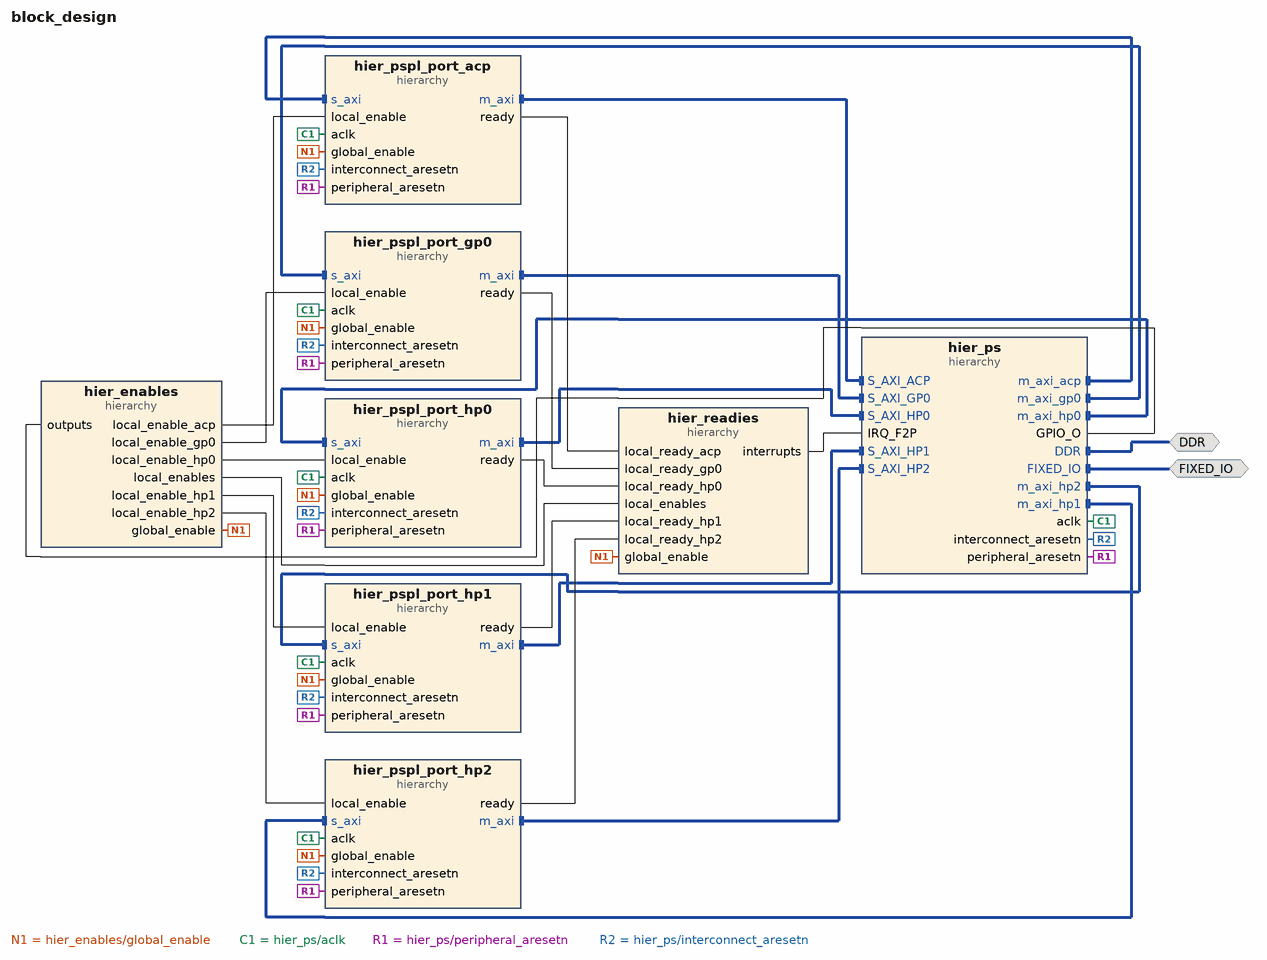
[diagram p0: block diagram of the top level]
# Vivado block design block_design, Vivado 2015.3
create_bd_design block_design

create_bd_intf_port -mode Master -vlnv xilinx.com:interface:ddrx_rtl:1.0 DDR
create_bd_intf_port -mode Master -vlnv xilinx.com:display_processing_system7:fixedio_rtl:1.0 FIXED_IO

create_bd_cell -type hier hier_pspl_port_acp
create_bd_cell -type hier hier_pspl_port_hp0
create_bd_cell -type hier hier_pspl_port_gp0
create_bd_cell -type hier hier_pspl_port_hp1
create_bd_cell -type hier hier_pspl_port_hp2
create_bd_cell -type hier hier_enables
create_bd_cell -type hier hier_readies
create_bd_cell -type hier hier_ps

# ---- hierarchy /hier_pspl_port_acp ----
current_bd_instance /hier_pspl_port_acp
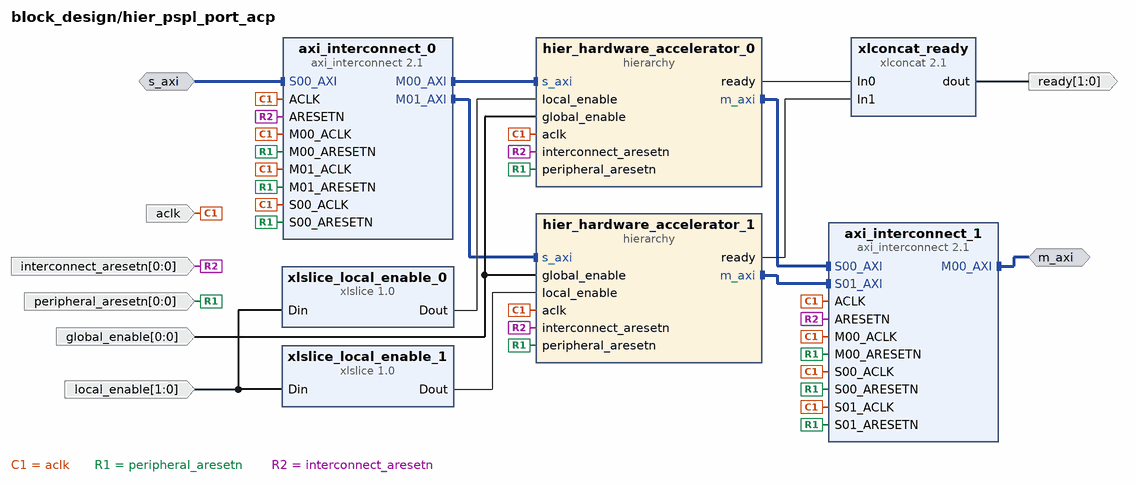
[diagram p1: block diagram inside /hier_pspl_port_acp]
create_bd_intf_pin -mode Master -vlnv xilinx.com:interface:aximm_rtl:1.0 m_axi
create_bd_intf_pin -mode Slave -vlnv xilinx.com:interface:aximm_rtl:1.0 s_axi
create_bd_pin -dir O -from 1 -to 0 ready
create_bd_pin -dir I -from 1 -to 0 local_enable
create_bd_pin -dir I -from 0 -to 0 global_enable
create_bd_pin -dir I aclk
create_bd_pin -dir I -from 0 -to 0 peripheral_aresetn
create_bd_pin -dir I -from 0 -to 0 interconnect_aresetn

create_bd_cell -type hier hier_hardware_accelerator_0
create_bd_cell -type hier hier_hardware_accelerator_1
create_bd_cell -type ip -vlnv xilinx.com:ip:axi_interconnect:2.1 axi_interconnect_0
set_property -dict {CONFIG.NUM_MI 2 CONFIG.STRATEGY 2} [get_bd_cells axi_interconnect_0]
create_bd_cell -type ip -vlnv xilinx.com:ip:axi_interconnect:2.1 axi_interconnect_1
set_property -dict {CONFIG.NUM_SI 2 CONFIG.NUM_MI 1 CONFIG.STRATEGY 2} [get_bd_cells axi_interconnect_1]
create_bd_cell -type ip -vlnv xilinx.com:ip:xlconcat:2.1 xlconcat_ready
create_bd_cell -type ip -vlnv xilinx.com:ip:xlslice:1.0 xlslice_local_enable_0
set_property -dict {CONFIG.DIN_WIDTH 2} [get_bd_cells xlslice_local_enable_0]
create_bd_cell -type ip -vlnv xilinx.com:ip:xlslice:1.0 xlslice_local_enable_1
set_property -dict {CONFIG.DIN_TO 1 CONFIG.DIN_FROM 1 CONFIG.DIN_WIDTH 2} [get_bd_cells xlslice_local_enable_1]

# ---- hierarchy /hier_pspl_port_acp/hier_hardware_accelerator_0 ----
current_bd_instance /hier_pspl_port_acp/hier_hardware_accelerator_0
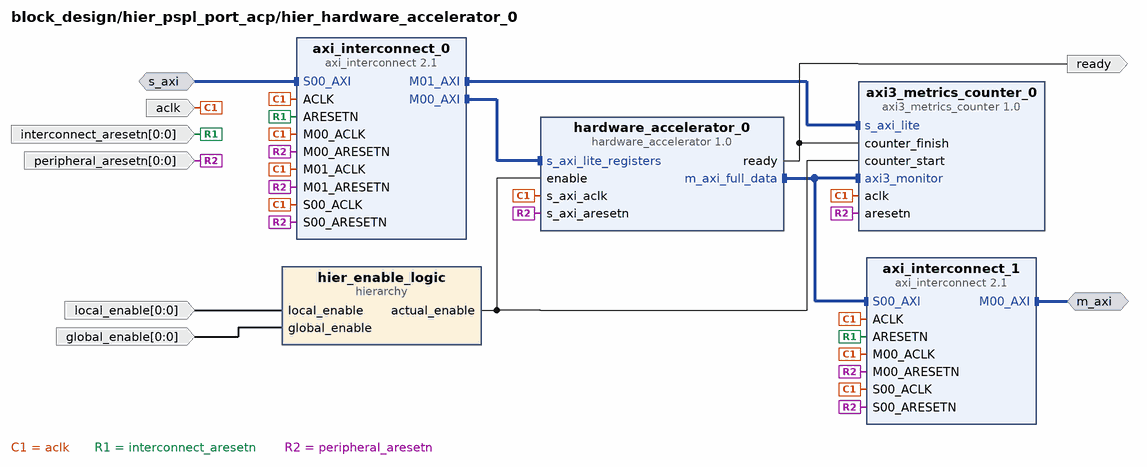
[diagram p2: block diagram inside /hier_pspl_port_acp/hier_hardware_accelerator_0]
create_bd_intf_pin -mode Slave -vlnv xilinx.com:interface:aximm_rtl:1.0 s_axi
create_bd_intf_pin -mode Master -vlnv xilinx.com:interface:aximm_rtl:1.0 m_axi
create_bd_pin -dir I -from 0 -to 0 local_enable
create_bd_pin -dir I -from 0 -to 0 global_enable
create_bd_pin -dir I aclk
create_bd_pin -dir I -from 0 -to 0 peripheral_aresetn
create_bd_pin -dir I -from 0 -to 0 interconnect_aresetn
create_bd_pin -dir O ready

create_bd_cell -type ip -vlnv xilinx.com:user:axi3_metrics_counter:1.0 axi3_metrics_counter_0
set_property -dict {CONFIG.C_axi3_monitor_ID_WIDTH 2 CONFIG.C_axi3_monitor_DATA_WIDTH 64} [get_bd_cells axi3_metrics_counter_0]
create_bd_cell -type hier hier_enable_logic
create_bd_cell -type ip -vlnv xilinx.com:ip:axi_interconnect:2.1 axi_interconnect_0
set_property -dict {CONFIG.STRATEGY 2} [get_bd_cells axi_interconnect_0]
create_bd_cell -type ip -vlnv xilinx.com:ip:axi_interconnect:2.1 axi_interconnect_1
set_property -dict {CONFIG.NUM_MI 1} [get_bd_cells axi_interconnect_1]
create_bd_cell -type ip -vlnv xilinx.com:user:hardware_accelerator:1.0 hardware_accelerator_0
set_property -dict [list \
  CONFIG.C_m_axi_full_data_DATA_WIDTH 64 \
  CONFIG.C_buffer_size 4 \
  CONFIG.C_m_axi_full_data_ID_WIDTH 2 \
] [get_bd_cells hardware_accelerator_0]

# ---- hierarchy /hier_pspl_port_acp/hier_hardware_accelerator_0/hier_enable_logic ----
current_bd_instance /hier_pspl_port_acp/hier_hardware_accelerator_0/hier_enable_logic
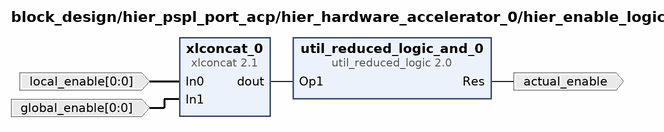
[diagram p3: block diagram inside /hier_pspl_port_acp/hier_hardware_accelerator_0/hier_enable_logic]
create_bd_pin -dir I -from 0 -to 0 local_enable
create_bd_pin -dir I -from 0 -to 0 global_enable
create_bd_pin -dir O actual_enable

create_bd_cell -type ip -vlnv xilinx.com:ip:util_reduced_logic:2.0 util_reduced_logic_and_0
set_property -dict {CONFIG.C_SIZE 2} [get_bd_cells util_reduced_logic_and_0]
create_bd_cell -type ip -vlnv xilinx.com:ip:xlconcat:2.1 xlconcat_0

# ---- hierarchy /hier_pspl_port_acp/hier_hardware_accelerator_1 ----
current_bd_instance /hier_pspl_port_acp/hier_hardware_accelerator_1
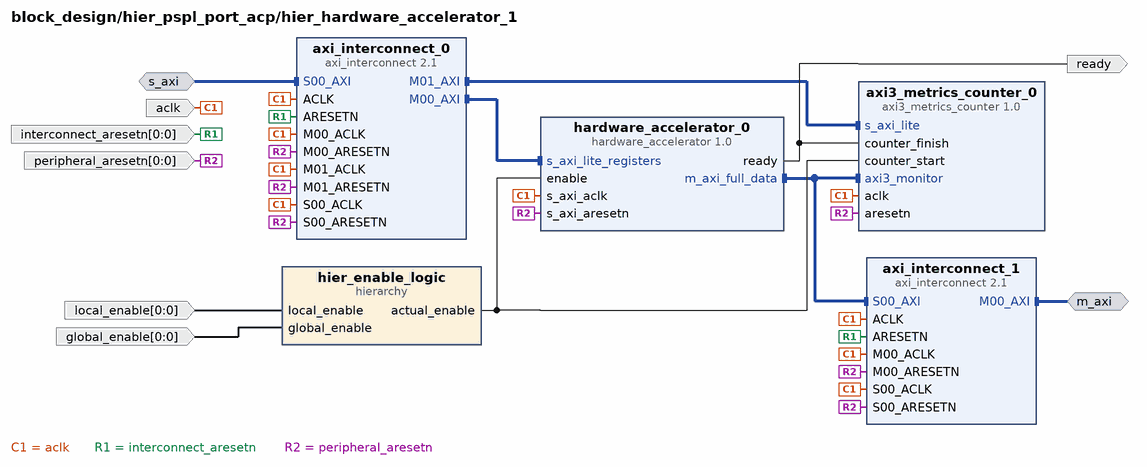
[diagram p4: block diagram inside /hier_pspl_port_acp/hier_hardware_accelerator_1]
create_bd_intf_pin -mode Slave -vlnv xilinx.com:interface:aximm_rtl:1.0 s_axi
create_bd_intf_pin -mode Master -vlnv xilinx.com:interface:aximm_rtl:1.0 m_axi
create_bd_pin -dir I -from 0 -to 0 local_enable
create_bd_pin -dir I -from 0 -to 0 global_enable
create_bd_pin -dir I aclk
create_bd_pin -dir I -from 0 -to 0 peripheral_aresetn
create_bd_pin -dir I -from 0 -to 0 interconnect_aresetn
create_bd_pin -dir O ready

create_bd_cell -type ip -vlnv xilinx.com:user:axi3_metrics_counter:1.0 axi3_metrics_counter_0
set_property -dict {CONFIG.C_axi3_monitor_ID_WIDTH 2 CONFIG.C_axi3_monitor_DATA_WIDTH 64} [get_bd_cells axi3_metrics_counter_0]
create_bd_cell -type hier hier_enable_logic
create_bd_cell -type ip -vlnv xilinx.com:ip:axi_interconnect:2.1 axi_interconnect_0
set_property -dict {CONFIG.STRATEGY 2} [get_bd_cells axi_interconnect_0]
create_bd_cell -type ip -vlnv xilinx.com:ip:axi_interconnect:2.1 axi_interconnect_1
set_property -dict {CONFIG.NUM_MI 1} [get_bd_cells axi_interconnect_1]
create_bd_cell -type ip -vlnv xilinx.com:user:hardware_accelerator:1.0 hardware_accelerator_0
set_property -dict [list \
  CONFIG.C_m_axi_full_data_DATA_WIDTH 64 \
  CONFIG.C_buffer_size 4 \
  CONFIG.C_m_axi_full_data_ID_WIDTH 2 \
  CONFIG.C_m_axi_full_data_ID 2 \
] [get_bd_cells hardware_accelerator_0]

# ---- hierarchy /hier_pspl_port_acp/hier_hardware_accelerator_1/hier_enable_logic ----
current_bd_instance /hier_pspl_port_acp/hier_hardware_accelerator_1/hier_enable_logic
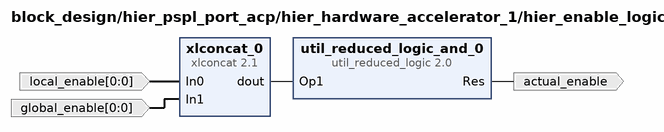
[diagram p5: block diagram inside /hier_pspl_port_acp/hier_hardware_accelerator_1/hier_enable_logic]
create_bd_pin -dir I -from 0 -to 0 local_enable
create_bd_pin -dir I -from 0 -to 0 global_enable
create_bd_pin -dir O actual_enable

create_bd_cell -type ip -vlnv xilinx.com:ip:util_reduced_logic:2.0 util_reduced_logic_and_0
set_property -dict {CONFIG.C_SIZE 2} [get_bd_cells util_reduced_logic_and_0]
create_bd_cell -type ip -vlnv xilinx.com:ip:xlconcat:2.1 xlconcat_0

# ---- hierarchy /hier_pspl_port_hp0 ----
current_bd_instance /hier_pspl_port_hp0
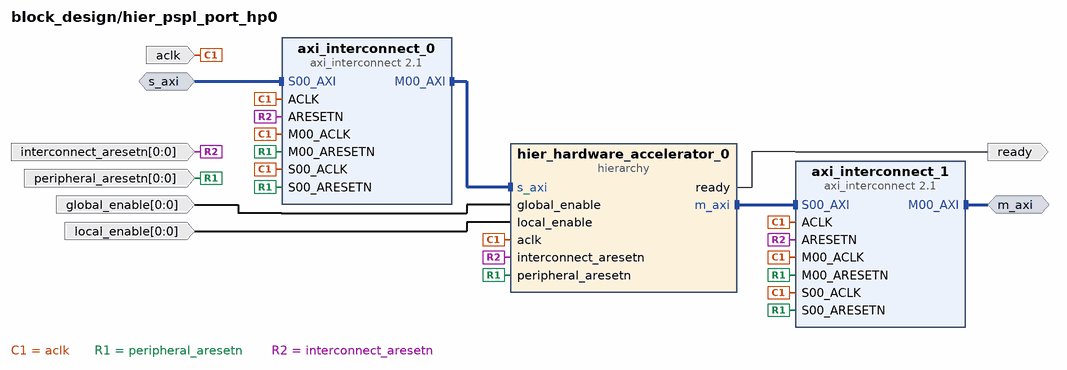
[diagram p6: block diagram inside /hier_pspl_port_hp0]
create_bd_intf_pin -mode Master -vlnv xilinx.com:interface:aximm_rtl:1.0 m_axi
create_bd_intf_pin -mode Slave -vlnv xilinx.com:interface:aximm_rtl:1.0 s_axi
create_bd_pin -dir O ready
create_bd_pin -dir I -from 0 -to 0 local_enable
create_bd_pin -dir I -from 0 -to 0 global_enable
create_bd_pin -dir I aclk
create_bd_pin -dir I -from 0 -to 0 peripheral_aresetn
create_bd_pin -dir I -from 0 -to 0 interconnect_aresetn

create_bd_cell -type hier hier_hardware_accelerator_0
create_bd_cell -type ip -vlnv xilinx.com:ip:axi_interconnect:2.1 axi_interconnect_0
set_property -dict {CONFIG.NUM_MI 1} [get_bd_cells axi_interconnect_0]
create_bd_cell -type ip -vlnv xilinx.com:ip:axi_interconnect:2.1 axi_interconnect_1
set_property -dict {CONFIG.NUM_MI 1} [get_bd_cells axi_interconnect_1]

# ---- hierarchy /hier_pspl_port_hp0/hier_hardware_accelerator_0 ----
current_bd_instance /hier_pspl_port_hp0/hier_hardware_accelerator_0
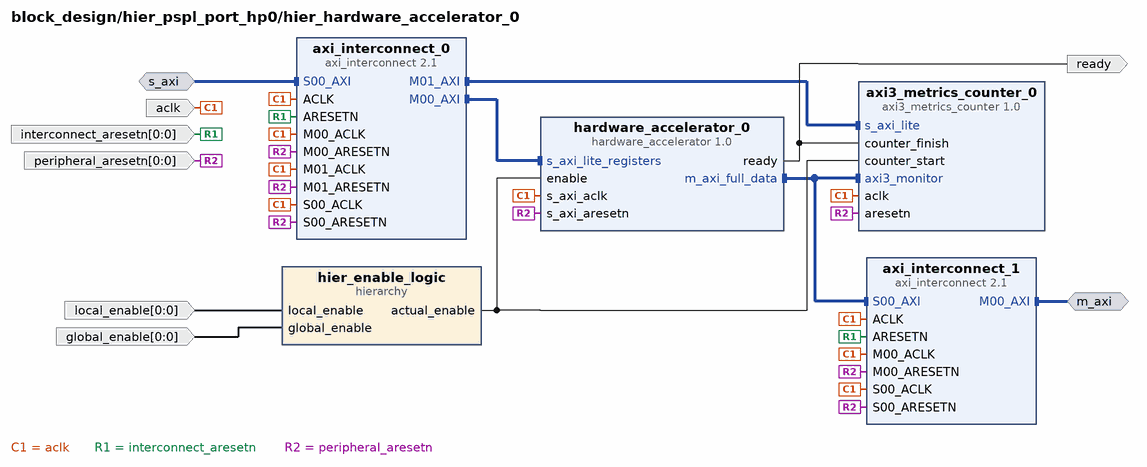
[diagram p7: block diagram inside /hier_pspl_port_hp0/hier_hardware_accelerator_0]
create_bd_intf_pin -mode Slave -vlnv xilinx.com:interface:aximm_rtl:1.0 s_axi
create_bd_intf_pin -mode Master -vlnv xilinx.com:interface:aximm_rtl:1.0 m_axi
create_bd_pin -dir I -from 0 -to 0 local_enable
create_bd_pin -dir I -from 0 -to 0 global_enable
create_bd_pin -dir I aclk
create_bd_pin -dir I -from 0 -to 0 peripheral_aresetn
create_bd_pin -dir I -from 0 -to 0 interconnect_aresetn
create_bd_pin -dir O ready

create_bd_cell -type ip -vlnv xilinx.com:user:axi3_metrics_counter:1.0 axi3_metrics_counter_0
set_property -dict {CONFIG.C_axi3_monitor_ID_WIDTH 6} [get_bd_cells axi3_metrics_counter_0]
create_bd_cell -type hier hier_enable_logic
create_bd_cell -type ip -vlnv xilinx.com:ip:axi_interconnect:2.1 axi_interconnect_0
create_bd_cell -type ip -vlnv xilinx.com:ip:axi_interconnect:2.1 axi_interconnect_1
set_property -dict {CONFIG.NUM_MI 1} [get_bd_cells axi_interconnect_1]
create_bd_cell -type ip -vlnv xilinx.com:user:hardware_accelerator:1.0 hardware_accelerator_0
set_property -dict {CONFIG.C_buffer_size 4 CONFIG.C_m_axi_full_data_ID_WIDTH 6} [get_bd_cells hardware_accelerator_0]

# ---- hierarchy /hier_pspl_port_hp0/hier_hardware_accelerator_0/hier_enable_logic ----
current_bd_instance /hier_pspl_port_hp0/hier_hardware_accelerator_0/hier_enable_logic
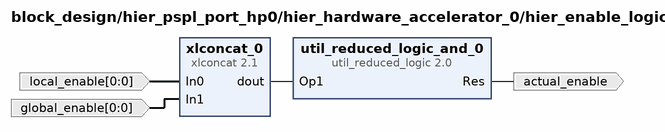
[diagram p8: block diagram inside /hier_pspl_port_hp0/hier_hardware_accelerator_0/hier_enable_logic]
create_bd_pin -dir I -from 0 -to 0 local_enable
create_bd_pin -dir I -from 0 -to 0 global_enable
create_bd_pin -dir O actual_enable

create_bd_cell -type ip -vlnv xilinx.com:ip:util_reduced_logic:2.0 util_reduced_logic_and_0
set_property -dict {CONFIG.C_SIZE 2} [get_bd_cells util_reduced_logic_and_0]
create_bd_cell -type ip -vlnv xilinx.com:ip:xlconcat:2.1 xlconcat_0

# ---- hierarchy /hier_pspl_port_gp0 ----
current_bd_instance /hier_pspl_port_gp0
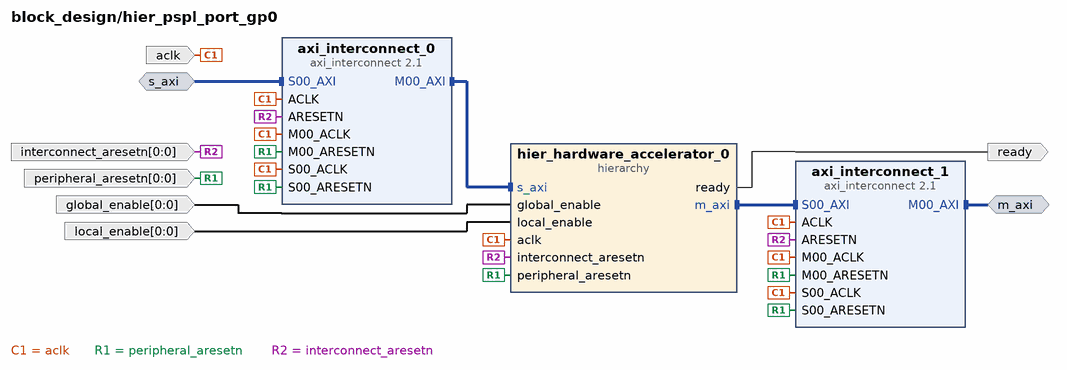
[diagram p9: block diagram inside /hier_pspl_port_gp0]
create_bd_intf_pin -mode Master -vlnv xilinx.com:interface:aximm_rtl:1.0 m_axi
create_bd_intf_pin -mode Slave -vlnv xilinx.com:interface:aximm_rtl:1.0 s_axi
create_bd_pin -dir O ready
create_bd_pin -dir I -from 0 -to 0 local_enable
create_bd_pin -dir I -from 0 -to 0 global_enable
create_bd_pin -dir I aclk
create_bd_pin -dir I -from 0 -to 0 peripheral_aresetn
create_bd_pin -dir I -from 0 -to 0 interconnect_aresetn

create_bd_cell -type hier hier_hardware_accelerator_0
create_bd_cell -type ip -vlnv xilinx.com:ip:axi_interconnect:2.1 axi_interconnect_0
set_property -dict {CONFIG.NUM_MI 1} [get_bd_cells axi_interconnect_0]
create_bd_cell -type ip -vlnv xilinx.com:ip:axi_interconnect:2.1 axi_interconnect_1
set_property -dict {CONFIG.NUM_MI 1} [get_bd_cells axi_interconnect_1]

# ---- hierarchy /hier_pspl_port_gp0/hier_hardware_accelerator_0 ----
current_bd_instance /hier_pspl_port_gp0/hier_hardware_accelerator_0
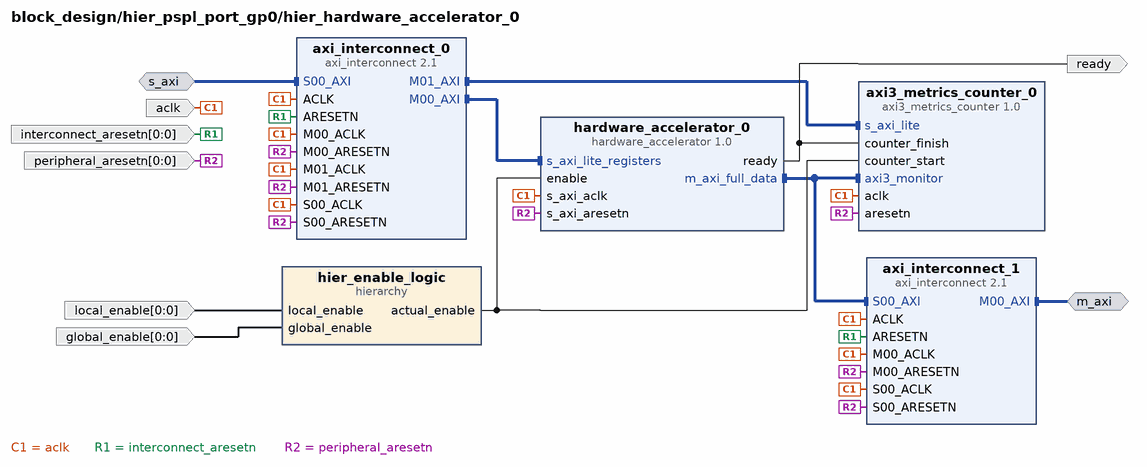
[diagram p10: block diagram inside /hier_pspl_port_gp0/hier_hardware_accelerator_0]
create_bd_intf_pin -mode Slave -vlnv xilinx.com:interface:aximm_rtl:1.0 s_axi
create_bd_intf_pin -mode Master -vlnv xilinx.com:interface:aximm_rtl:1.0 m_axi
create_bd_pin -dir I -from 0 -to 0 local_enable
create_bd_pin -dir I -from 0 -to 0 global_enable
create_bd_pin -dir I aclk
create_bd_pin -dir I -from 0 -to 0 peripheral_aresetn
create_bd_pin -dir I -from 0 -to 0 interconnect_aresetn
create_bd_pin -dir O ready

create_bd_cell -type ip -vlnv xilinx.com:user:axi3_metrics_counter:1.0 axi3_metrics_counter_0
set_property -dict {CONFIG.C_axi3_monitor_ID_WIDTH 6} [get_bd_cells axi3_metrics_counter_0]
create_bd_cell -type hier hier_enable_logic
create_bd_cell -type ip -vlnv xilinx.com:ip:axi_interconnect:2.1 axi_interconnect_0
create_bd_cell -type ip -vlnv xilinx.com:ip:axi_interconnect:2.1 axi_interconnect_1
set_property -dict {CONFIG.NUM_MI 1} [get_bd_cells axi_interconnect_1]
create_bd_cell -type ip -vlnv xilinx.com:user:hardware_accelerator:1.0 hardware_accelerator_0
set_property -dict {CONFIG.C_buffer_size 4 CONFIG.C_m_axi_full_data_ID_WIDTH 6} [get_bd_cells hardware_accelerator_0]

# ---- hierarchy /hier_pspl_port_gp0/hier_hardware_accelerator_0/hier_enable_logic ----
current_bd_instance /hier_pspl_port_gp0/hier_hardware_accelerator_0/hier_enable_logic
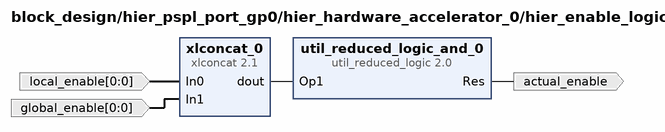
[diagram p11: block diagram inside /hier_pspl_port_gp0/hier_hardware_accelerator_0/hier_enable_logic]
create_bd_pin -dir I -from 0 -to 0 local_enable
create_bd_pin -dir I -from 0 -to 0 global_enable
create_bd_pin -dir O actual_enable

create_bd_cell -type ip -vlnv xilinx.com:ip:util_reduced_logic:2.0 util_reduced_logic_and_0
set_property -dict {CONFIG.C_SIZE 2} [get_bd_cells util_reduced_logic_and_0]
create_bd_cell -type ip -vlnv xilinx.com:ip:xlconcat:2.1 xlconcat_0

# ---- hierarchy /hier_pspl_port_hp1 ----
current_bd_instance /hier_pspl_port_hp1
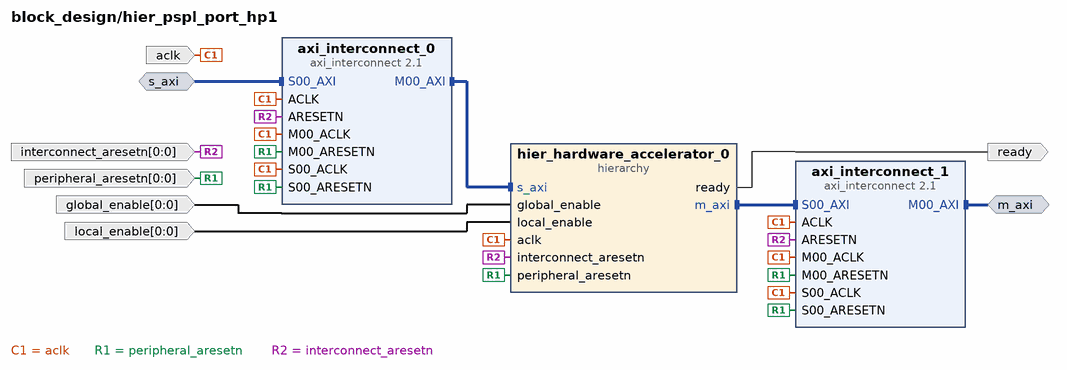
[diagram p12: block diagram inside /hier_pspl_port_hp1]
create_bd_intf_pin -mode Master -vlnv xilinx.com:interface:aximm_rtl:1.0 m_axi
create_bd_intf_pin -mode Slave -vlnv xilinx.com:interface:aximm_rtl:1.0 s_axi
create_bd_pin -dir O ready
create_bd_pin -dir I -from 0 -to 0 local_enable
create_bd_pin -dir I -from 0 -to 0 global_enable
create_bd_pin -dir I aclk
create_bd_pin -dir I -from 0 -to 0 peripheral_aresetn
create_bd_pin -dir I -from 0 -to 0 interconnect_aresetn

create_bd_cell -type hier hier_hardware_accelerator_0
create_bd_cell -type ip -vlnv xilinx.com:ip:axi_interconnect:2.1 axi_interconnect_0
set_property -dict {CONFIG.NUM_MI 1} [get_bd_cells axi_interconnect_0]
create_bd_cell -type ip -vlnv xilinx.com:ip:axi_interconnect:2.1 axi_interconnect_1
set_property -dict {CONFIG.NUM_MI 1} [get_bd_cells axi_interconnect_1]

# ---- hierarchy /hier_pspl_port_hp1/hier_hardware_accelerator_0 ----
current_bd_instance /hier_pspl_port_hp1/hier_hardware_accelerator_0
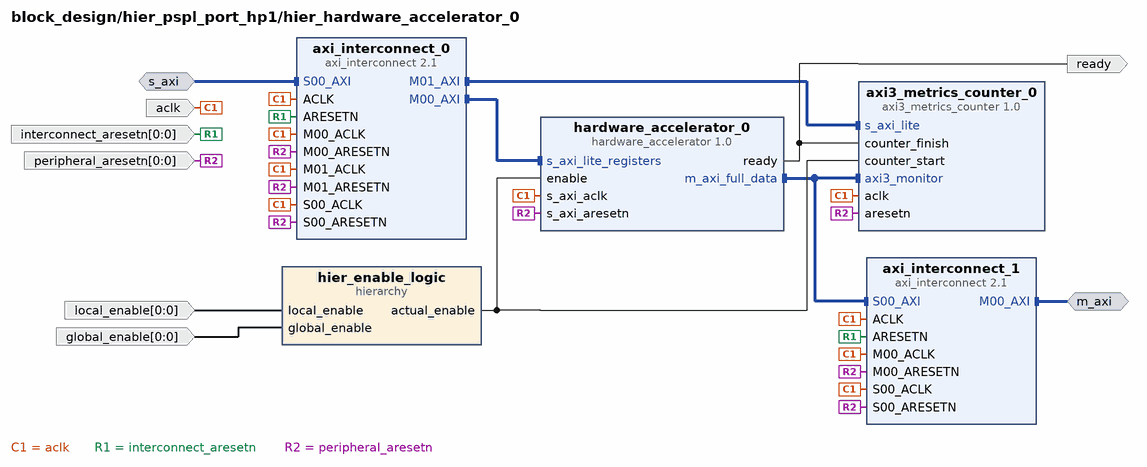
[diagram p13: block diagram inside /hier_pspl_port_hp1/hier_hardware_accelerator_0]
create_bd_intf_pin -mode Slave -vlnv xilinx.com:interface:aximm_rtl:1.0 s_axi
create_bd_intf_pin -mode Master -vlnv xilinx.com:interface:aximm_rtl:1.0 m_axi
create_bd_pin -dir I -from 0 -to 0 local_enable
create_bd_pin -dir I -from 0 -to 0 global_enable
create_bd_pin -dir I aclk
create_bd_pin -dir I -from 0 -to 0 peripheral_aresetn
create_bd_pin -dir I -from 0 -to 0 interconnect_aresetn
create_bd_pin -dir O ready

create_bd_cell -type ip -vlnv xilinx.com:user:axi3_metrics_counter:1.0 axi3_metrics_counter_0
set_property -dict {CONFIG.C_axi3_monitor_ID_WIDTH 6 CONFIG.C_axi3_monitor_DATA_WIDTH 64} [get_bd_cells axi3_metrics_counter_0]
create_bd_cell -type hier hier_enable_logic
create_bd_cell -type ip -vlnv xilinx.com:ip:axi_interconnect:2.1 axi_interconnect_0
create_bd_cell -type ip -vlnv xilinx.com:ip:axi_interconnect:2.1 axi_interconnect_1
set_property -dict {CONFIG.NUM_MI 1} [get_bd_cells axi_interconnect_1]
create_bd_cell -type ip -vlnv xilinx.com:user:hardware_accelerator:1.0 hardware_accelerator_0
set_property -dict [list \
  CONFIG.C_m_axi_full_data_DATA_WIDTH 64 \
  CONFIG.C_buffer_size 4 \
  CONFIG.C_m_axi_full_data_ID_WIDTH 6 \
] [get_bd_cells hardware_accelerator_0]

# ---- hierarchy /hier_pspl_port_hp1/hier_hardware_accelerator_0/hier_enable_logic ----
current_bd_instance /hier_pspl_port_hp1/hier_hardware_accelerator_0/hier_enable_logic
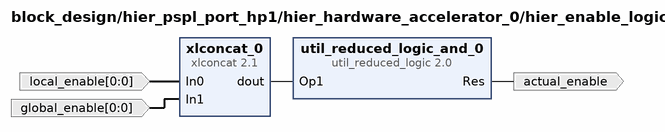
[diagram p14: block diagram inside /hier_pspl_port_hp1/hier_hardware_accelerator_0/hier_enable_logic]
create_bd_pin -dir I -from 0 -to 0 local_enable
create_bd_pin -dir I -from 0 -to 0 global_enable
create_bd_pin -dir O actual_enable

create_bd_cell -type ip -vlnv xilinx.com:ip:util_reduced_logic:2.0 util_reduced_logic_and_0
set_property -dict {CONFIG.C_SIZE 2} [get_bd_cells util_reduced_logic_and_0]
create_bd_cell -type ip -vlnv xilinx.com:ip:xlconcat:2.1 xlconcat_0

# ---- hierarchy /hier_pspl_port_hp2 ----
current_bd_instance /hier_pspl_port_hp2
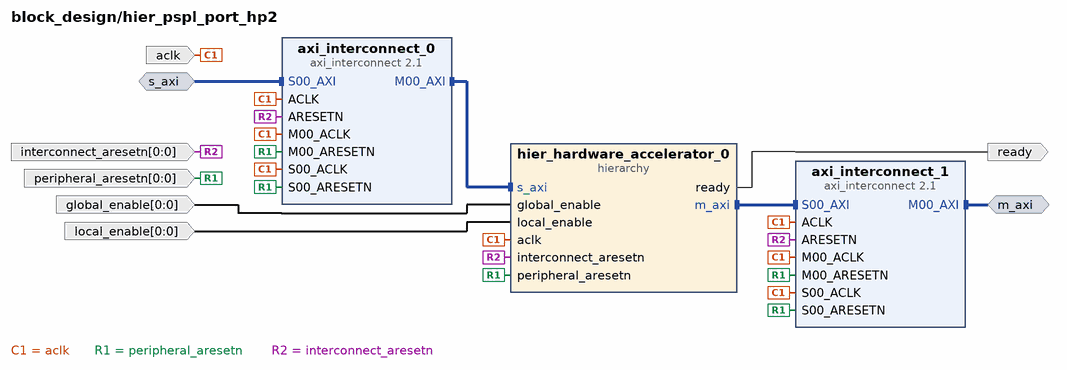
[diagram p15: block diagram inside /hier_pspl_port_hp2]
create_bd_intf_pin -mode Master -vlnv xilinx.com:interface:aximm_rtl:1.0 m_axi
create_bd_intf_pin -mode Slave -vlnv xilinx.com:interface:aximm_rtl:1.0 s_axi
create_bd_pin -dir O ready
create_bd_pin -dir I -from 0 -to 0 local_enable
create_bd_pin -dir I -from 0 -to 0 global_enable
create_bd_pin -dir I aclk
create_bd_pin -dir I -from 0 -to 0 peripheral_aresetn
create_bd_pin -dir I -from 0 -to 0 interconnect_aresetn

create_bd_cell -type hier hier_hardware_accelerator_0
create_bd_cell -type ip -vlnv xilinx.com:ip:axi_interconnect:2.1 axi_interconnect_0
set_property -dict {CONFIG.NUM_MI 1} [get_bd_cells axi_interconnect_0]
create_bd_cell -type ip -vlnv xilinx.com:ip:axi_interconnect:2.1 axi_interconnect_1
set_property -dict {CONFIG.NUM_MI 1} [get_bd_cells axi_interconnect_1]

# ---- hierarchy /hier_pspl_port_hp2/hier_hardware_accelerator_0 ----
current_bd_instance /hier_pspl_port_hp2/hier_hardware_accelerator_0
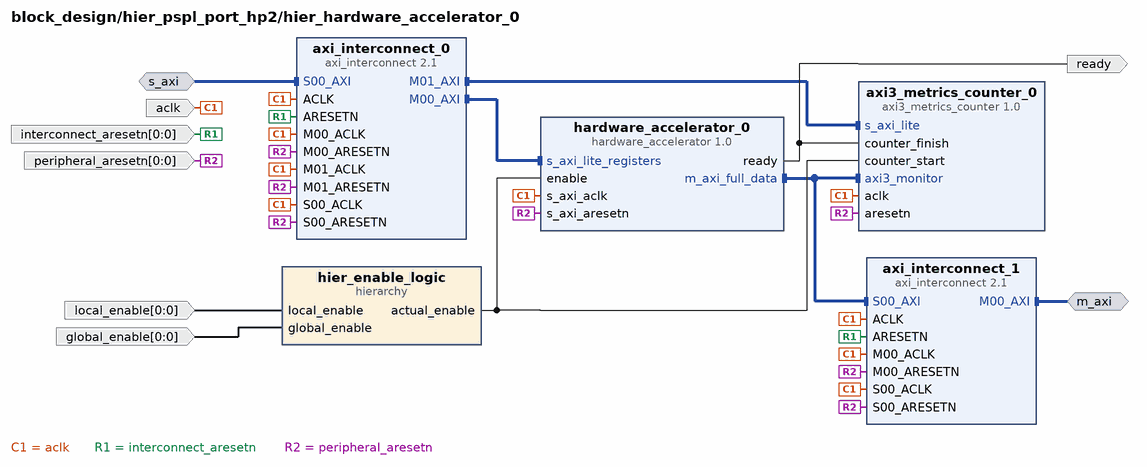
[diagram p16: block diagram inside /hier_pspl_port_hp2/hier_hardware_accelerator_0]
create_bd_intf_pin -mode Slave -vlnv xilinx.com:interface:aximm_rtl:1.0 s_axi
create_bd_intf_pin -mode Master -vlnv xilinx.com:interface:aximm_rtl:1.0 m_axi
create_bd_pin -dir I -from 0 -to 0 local_enable
create_bd_pin -dir I -from 0 -to 0 global_enable
create_bd_pin -dir I aclk
create_bd_pin -dir I -from 0 -to 0 peripheral_aresetn
create_bd_pin -dir I -from 0 -to 0 interconnect_aresetn
create_bd_pin -dir O ready

create_bd_cell -type ip -vlnv xilinx.com:user:axi3_metrics_counter:1.0 axi3_metrics_counter_0
set_property -dict {CONFIG.C_axi3_monitor_ID_WIDTH 6 CONFIG.C_axi3_monitor_DATA_WIDTH 64} [get_bd_cells axi3_metrics_counter_0]
create_bd_cell -type hier hier_enable_logic
create_bd_cell -type ip -vlnv xilinx.com:ip:axi_interconnect:2.1 axi_interconnect_0
create_bd_cell -type ip -vlnv xilinx.com:ip:axi_interconnect:2.1 axi_interconnect_1
set_property -dict {CONFIG.NUM_MI 1} [get_bd_cells axi_interconnect_1]
create_bd_cell -type ip -vlnv xilinx.com:user:hardware_accelerator:1.0 hardware_accelerator_0
set_property -dict [list \
  CONFIG.C_m_axi_full_data_DATA_WIDTH 64 \
  CONFIG.C_buffer_size 4 \
  CONFIG.C_m_axi_full_data_ID_WIDTH 6 \
] [get_bd_cells hardware_accelerator_0]

# ---- hierarchy /hier_pspl_port_hp2/hier_hardware_accelerator_0/hier_enable_logic ----
current_bd_instance /hier_pspl_port_hp2/hier_hardware_accelerator_0/hier_enable_logic
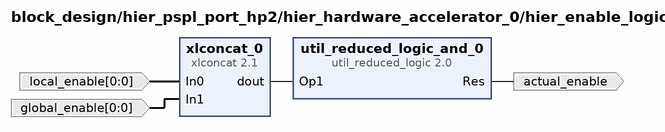
[diagram p17: block diagram inside /hier_pspl_port_hp2/hier_hardware_accelerator_0/hier_enable_logic]
create_bd_pin -dir I -from 0 -to 0 local_enable
create_bd_pin -dir I -from 0 -to 0 global_enable
create_bd_pin -dir O actual_enable

create_bd_cell -type ip -vlnv xilinx.com:ip:util_reduced_logic:2.0 util_reduced_logic_and_0
set_property -dict {CONFIG.C_SIZE 2} [get_bd_cells util_reduced_logic_and_0]
create_bd_cell -type ip -vlnv xilinx.com:ip:xlconcat:2.1 xlconcat_0

# ---- hierarchy /hier_enables ----
current_bd_instance /hier_enables
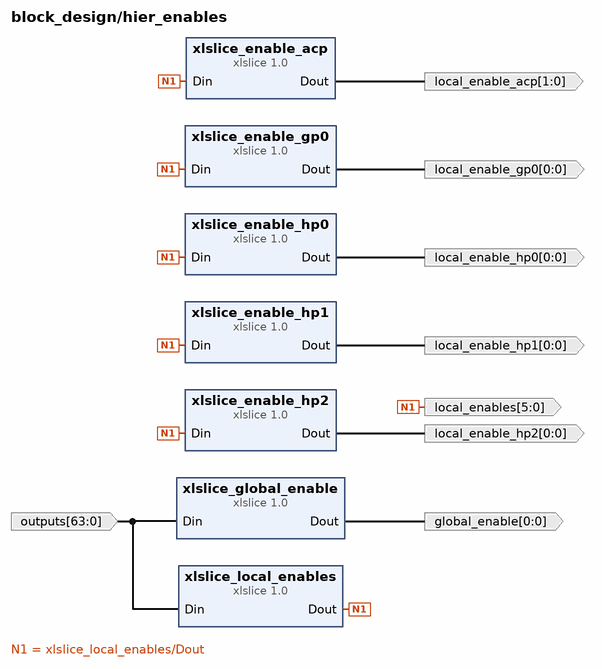
[diagram p18: block diagram inside /hier_enables]
create_bd_pin -dir I -from 63 -to 0 outputs
create_bd_pin -dir O -from 1 -to 0 local_enable_acp
create_bd_pin -dir O -from 0 -to 0 local_enable_gp0
create_bd_pin -dir O -from 0 -to 0 local_enable_hp0
create_bd_pin -dir O -from 0 -to 0 local_enable_hp1
create_bd_pin -dir O -from 0 -to 0 local_enable_hp2
create_bd_pin -dir O -from 5 -to 0 local_enables
create_bd_pin -dir O -from 0 -to 0 global_enable

create_bd_cell -type ip -vlnv xilinx.com:ip:xlslice:1.0 xlslice_global_enable
set_property -dict {CONFIG.DIN_WIDTH 64} [get_bd_cells xlslice_global_enable]
create_bd_cell -type ip -vlnv xilinx.com:ip:xlslice:1.0 xlslice_local_enables
set_property -dict {CONFIG.DIN_TO 1 CONFIG.DIN_FROM 6 CONFIG.DIN_WIDTH 64} [get_bd_cells xlslice_local_enables]
create_bd_cell -type ip -vlnv xilinx.com:ip:xlslice:1.0 xlslice_enable_acp
set_property -dict {CONFIG.DIN_FROM 1 CONFIG.DIN_WIDTH 6} [get_bd_cells xlslice_enable_acp]
create_bd_cell -type ip -vlnv xilinx.com:ip:xlslice:1.0 xlslice_enable_gp0
set_property -dict {CONFIG.DIN_TO 2 CONFIG.DIN_FROM 2 CONFIG.DIN_WIDTH 6} [get_bd_cells xlslice_enable_gp0]
create_bd_cell -type ip -vlnv xilinx.com:ip:xlslice:1.0 xlslice_enable_hp0
set_property -dict {CONFIG.DIN_TO 3 CONFIG.DIN_FROM 3 CONFIG.DIN_WIDTH 6} [get_bd_cells xlslice_enable_hp0]
create_bd_cell -type ip -vlnv xilinx.com:ip:xlslice:1.0 xlslice_enable_hp1
set_property -dict {CONFIG.DIN_TO 4 CONFIG.DIN_FROM 4 CONFIG.DIN_WIDTH 6} [get_bd_cells xlslice_enable_hp1]
create_bd_cell -type ip -vlnv xilinx.com:ip:xlslice:1.0 xlslice_enable_hp2
set_property -dict {CONFIG.DIN_TO 5 CONFIG.DIN_FROM 5 CONFIG.DIN_WIDTH 6} [get_bd_cells xlslice_enable_hp2]

# ---- hierarchy /hier_readies ----
current_bd_instance /hier_readies
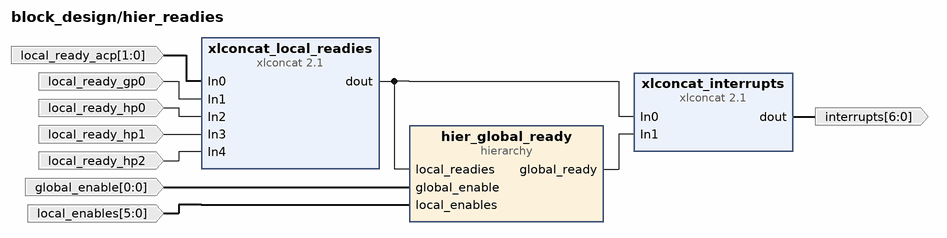
[diagram p19: block diagram inside /hier_readies]
create_bd_pin -dir I -from 1 -to 0 local_ready_acp
create_bd_pin -dir I local_ready_gp0
create_bd_pin -dir I local_ready_hp0
create_bd_pin -dir I local_ready_hp1
create_bd_pin -dir I local_ready_hp2
create_bd_pin -dir O -from 6 -to 0 interrupts
create_bd_pin -dir I -from 0 -to 0 global_enable
create_bd_pin -dir I -from 5 -to 0 local_enables

create_bd_cell -type hier hier_global_ready
create_bd_cell -type ip -vlnv xilinx.com:ip:xlconcat:2.1 xlconcat_interrupts
create_bd_cell -type ip -vlnv xilinx.com:ip:xlconcat:2.1 xlconcat_local_readies
set_property -dict [list \
  CONFIG.NUM_PORTS 5 \
  CONFIG.IN0_WIDTH 2 \
  CONFIG.IN1_WIDTH 1 \
  CONFIG.IN2_WIDTH 1 \
  CONFIG.IN3_WIDTH 1 \
  CONFIG.IN4_WIDTH 1 \
] [get_bd_cells xlconcat_local_readies]

# ---- hierarchy /hier_readies/hier_global_ready ----
current_bd_instance /hier_readies/hier_global_ready
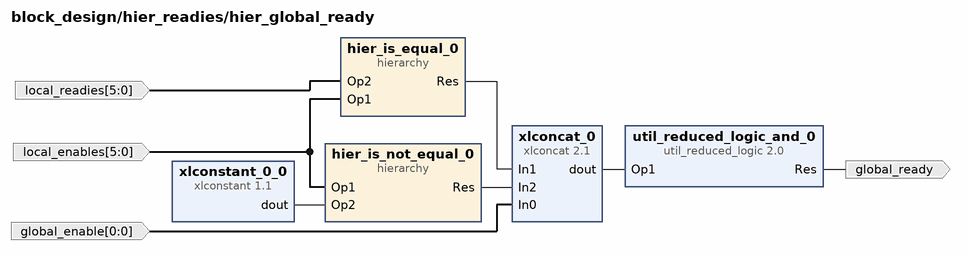
[diagram p20: block diagram inside /hier_readies/hier_global_ready]
create_bd_pin -dir I -from 0 -to 0 global_enable
create_bd_pin -dir I -from 5 -to 0 local_enables
create_bd_pin -dir I -from 5 -to 0 local_readies
create_bd_pin -dir O global_ready

create_bd_cell -type hier hier_is_equal_0
create_bd_cell -type hier hier_is_not_equal_0
create_bd_cell -type ip -vlnv xilinx.com:ip:util_reduced_logic:2.0 util_reduced_logic_and_0
set_property -dict {CONFIG.C_SIZE 3} [get_bd_cells util_reduced_logic_and_0]
create_bd_cell -type ip -vlnv xilinx.com:ip:xlconcat:2.1 xlconcat_0
set_property -dict {CONFIG.NUM_PORTS 3} [get_bd_cells xlconcat_0]
create_bd_cell -type ip -vlnv xilinx.com:ip:xlconstant:1.1 xlconstant_0_0
set_property -dict {CONFIG.CONST_WIDTH 6 CONFIG.CONST_VAL 0} [get_bd_cells xlconstant_0_0]

# ---- hierarchy /hier_readies/hier_global_ready/hier_is_equal_0 ----
current_bd_instance /hier_readies/hier_global_ready/hier_is_equal_0
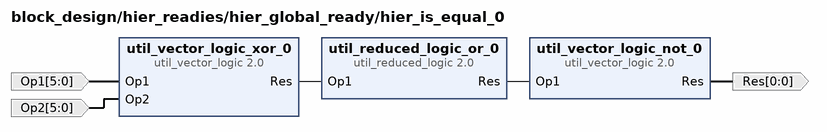
[diagram p21: block diagram inside /hier_readies/hier_global_ready/hier_is_equal_0]
create_bd_pin -dir I -from 5 -to 0 Op1
create_bd_pin -dir I -from 5 -to 0 Op2
create_bd_pin -dir O -from 0 -to 0 Res

create_bd_cell -type ip -vlnv xilinx.com:ip:util_reduced_logic:2.0 util_reduced_logic_or_0
set_property -dict {CONFIG.C_SIZE 6 CONFIG.C_OPERATION or} [get_bd_cells util_reduced_logic_or_0]
create_bd_cell -type ip -vlnv xilinx.com:ip:util_vector_logic:2.0 util_vector_logic_xor_0
set_property -dict {CONFIG.C_SIZE 6 CONFIG.C_OPERATION xor} [get_bd_cells util_vector_logic_xor_0]
create_bd_cell -type ip -vlnv xilinx.com:ip:util_vector_logic:2.0 util_vector_logic_not_0
set_property -dict {CONFIG.C_SIZE 1 CONFIG.C_OPERATION not} [get_bd_cells util_vector_logic_not_0]

# ---- hierarchy /hier_readies/hier_global_ready/hier_is_not_equal_0 ----
current_bd_instance /hier_readies/hier_global_ready/hier_is_not_equal_0
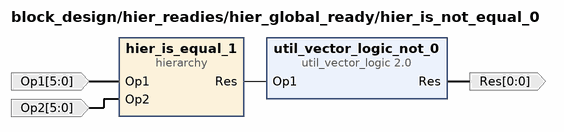
[diagram p22: block diagram inside /hier_readies/hier_global_ready/hier_is_not_equal_0]
create_bd_pin -dir O -from 0 -to 0 Res
create_bd_pin -dir I -from 5 -to 0 Op1
create_bd_pin -dir I -from 5 -to 0 Op2

create_bd_cell -type hier hier_is_equal_1
create_bd_cell -type ip -vlnv xilinx.com:ip:util_vector_logic:2.0 util_vector_logic_not_0
set_property -dict {CONFIG.C_SIZE 1 CONFIG.C_OPERATION not} [get_bd_cells util_vector_logic_not_0]

# ---- hierarchy /hier_readies/hier_global_ready/hier_is_not_equal_0/hier_is_equal_1 ----
current_bd_instance /hier_readies/hier_global_ready/hier_is_not_equal_0/hier_is_equal_1
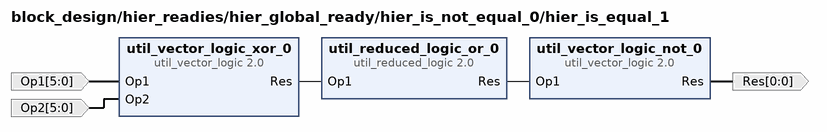
[diagram p23: block diagram inside /hier_readies/hier_global_ready/hier_is_not_equal_0/hier_is_equal_1]
create_bd_pin -dir I -from 5 -to 0 Op1
create_bd_pin -dir I -from 5 -to 0 Op2
create_bd_pin -dir O -from 0 -to 0 Res

create_bd_cell -type ip -vlnv xilinx.com:ip:util_reduced_logic:2.0 util_reduced_logic_or_0
set_property -dict {CONFIG.C_SIZE 6 CONFIG.C_OPERATION or} [get_bd_cells util_reduced_logic_or_0]
create_bd_cell -type ip -vlnv xilinx.com:ip:util_vector_logic:2.0 util_vector_logic_not_0
set_property -dict {CONFIG.C_SIZE 1 CONFIG.C_OPERATION not} [get_bd_cells util_vector_logic_not_0]
create_bd_cell -type ip -vlnv xilinx.com:ip:util_vector_logic:2.0 util_vector_logic_xor_0
set_property -dict {CONFIG.C_SIZE 6 CONFIG.C_OPERATION xor} [get_bd_cells util_vector_logic_xor_0]

# ---- hierarchy /hier_ps ----
current_bd_instance /hier_ps
